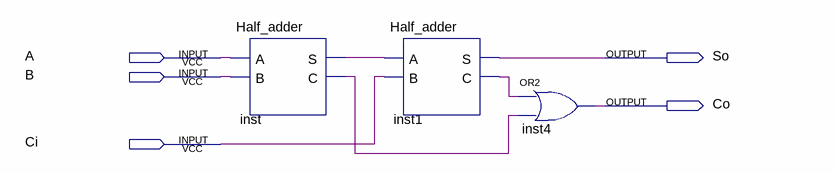
[diagram p0: schematic sheet]
// Quartus schematic Full_adder_S.bdf as structural Verilog: 3 symbols, 5 pins
module Full_adder_S (
  input  A,
  input  B,
  input  Ci,
  output So,
  output Co
);

  wire inst1_c, inst_c, inst_s;

  Half_adder inst (.A(A), .B(B), .S(inst_s), .C(inst_c));
  Half_adder inst1 (.A(inst_s), .B(Ci), .S(So), .C(inst1_c));
  or inst4 (Co, inst1_c, inst_c);
endmodule
